# EAGLE design untitled (EAGLE 8.4.1)
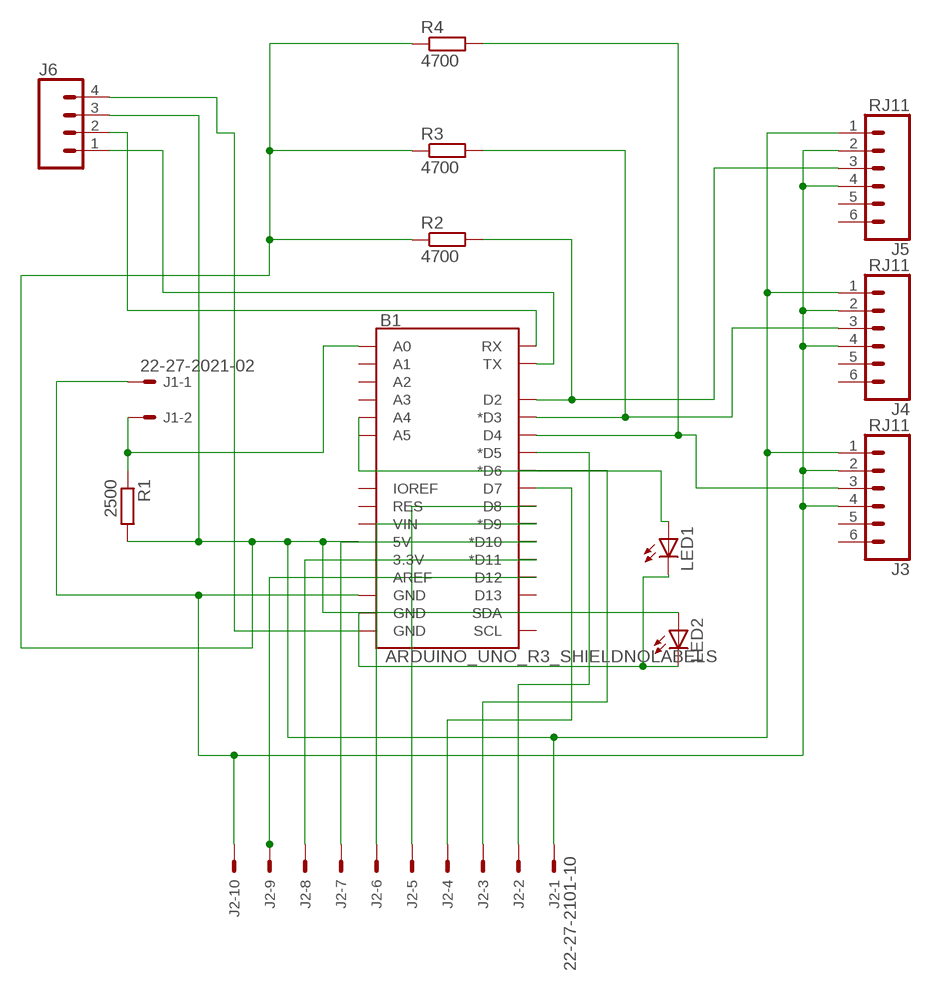
[diagram p0: schematic, sheet 1]

## Parts
B1  ARDUINO_UNO_R3_SHIELDNOLABELS  [UNO_R3_SHIELD_NOLABELS]
J1  22-27-2021-02  [6410-02]
J2  22-27-2101-10  [6410-10]
J3  RJ11  RJ11-6  [RJ11-6]
J4  RJ11  RJ11-6  [RJ11-6]
J5  RJ11  RJ11-6  [RJ11-6]
J6  CONN_04  [1X04]
LED1  LED3MM  [LED3MM]
LED2  LED3MM  [LED3MM]
R1  2500  R-EU_R1206  [R1206]
R2  4700  R-EU_R1206  [R1206]
R3  4700  R-EU_R1206  [R1206]
R4  4700  R-EU_R1206  [R1206]

## Nets
N$1: B1.5V J2.1 J3.1 J4.1 J5.1 J6.3 LED2.A R1.2 R2.1 R3.1 R4.1
N$2: B1.GND@2(GND) J1.1 J2.10 J3.2 J3.4 J4.2 J4.4 J5.2 J5.4
N$3: B1.D12 J2.9
N$4: B1.A0 J1.2 R1.1
N$5: B1.D5(*D5) J2.2
N$6: B1.D6(*D6) J2.3
N$7: B1.D2 J5.3 R2.2
N$8: B1.D3(*D3) J4.3 R3.2
N$9: B1.D4 J3.3 R4.2
N$10: B1.D7 J2.4
N$11: B1.D8 J2.5
N$12: B1.D9(*D9) J2.6
N$13: B1.D10(*D10) J2.7
N$14: B1.D11(*D11) J2.8
N$15: B1.TX J6.1
N$16: B1.RX J6.2
N$17: B1.GND@0(GND) J6.4
N$18: B1.GND@1(GND) LED1.K(C) LED2.K(C)
N$20: B1.A4 LED1.A
Unconnected: B1.3.3V B1.A1 B1.A2 B1.A3 B1.A5 B1.AREF B1.D13 B1.IOREF B1.RES B1.SCL B1.SDA B1.VIN J3.5 J3.6 J4.5 J4.6 J5.5 J5.6

## Library data of the parts
B1 = SparkFun-Boards:ARDUINO_UNO_R3_SHIELD: Arduino R3 Shield Footprint Shield form compatible with the Arduino Uno R3. SparkFun Products: MG2639 Cellular Shield <https://www.sparkfun.com/products/13120> MIDI Shield <https://www.sparkfun.com/products/12898> R3 Stackable Headers Kit <https://www.sparkfun.com/products/11417>
J1 = con-molex:22-?-02: CONNECTOR wire to board 2.54 mm (.1 inch) pitch header; OC_FARNELL: unknown; OC_NEWARK: unknown
J2 = con-molex_neu:22-?-10: CONNECTOR wire to board 2.54 mm (.1 inch) pitch header; OC_FARNELL: unknown; OC_NEWARK: unknown
J3-J5 = SparkFun-Connectors:RJ11-6: RJ11 Jack - 6 pin Commonly found on CAT3 devices and some Microchip programmers. Here is the connector we sell at SparkFun: RJ11 6-Pin Connector <https://www.sparkfun.com/products/132> (PRT-00132) Datasheet <http://www.sparkfun.com/datasheets/Prototyping/Connectors/RJ11-Datasheet.pdf> It is used on this SparkFun product: SparkFun Weather Shield <https://www.sparkfun.com/products/12081> (DEV-12081) Weather Meters <https://www.sparkfun.com/products/8942> (SEN-08942); PROD_ID: CONN-08590; SF_ID: PRT-00132
J6 = SparkFun-Connectors:CONN_04: Multi connection point. Often used as Generic Header-pin footprint for 0.1 inch spaced/style header connections On any of the 0.1 inch spaced packages, you can populate with these: Break Away Headers - Straight <https://www.sparkfun.com/products/116> (PRT-00116) Break Away Male Headers - Right Angle <https://www.sparkfun.com/products/553> (PRT-00553) Female Headers <https://www.sparkfun.com/products/115> (PRT-00115) Break Away Headers - Machine Pin <https://www.sparkfun.com/products/117> (PRT-00117) Break Away Female Headers - Swiss Machine Pin <https://www.sparkfun.com/products/743> (PRT-00743) For SCREWTERMINALS and SPRING TERMINALS visit here: Screw Terimnals on SparkFun.com <https://www.sparkfun.com/search/results?term=Screw+Terminals> (5mm/3.5mm/2.54mm spacing) This device is also useful as a general connection point to wire up your design to another part of your project. Our various solder wires solder well into these plated through hole pads. Hook-Up Wire - Assortment (Stranded, 22 AWG) <https://www.sparkfun.com/products/11375> (PRT-11375) Hook-Up Wire - Assortment (Solid Core, 22 AWG) <https://www.sparkfun.com/products/11367> (PRT-11367) View the entire wire category on our website here <https://www.sparkfun.com/categories/141> Special notes: Molex polarized connector foot print use with SKU : PRT-08231 with associated crimp pins and housings. 1MM SMD Version SKU: PRT-10208; PROD_ID: CONN-09696
LED1 LED2 = led_neu:LED: LED OSRAM: - CHIPLED LG R971, LG N971, LY N971, LG Q971, LY Q971, LO R971, LY R971 LH N974, LH R974 LS Q976, LO Q976, LY Q976 LO Q996 - Hyper CHIPLED LW Q18S LB Q993, LB Q99A, LB R99A - SideLED LS A670, LO A670, LY A670, LG A670, LP A670 LB A673, LV A673, LT A673, LW A673 LH A674 LY A675 LS A676, LA A676, LO A676, LY A676, LW A676 LS A679, LY A679, LG A679 - Hyper Micro SIDELED® LS Y876, LA Y876, LO Y876, LY Y876 LT Y87S - SmartLED LW L88C, LW L88S LB L89C, LB L89S, LG L890 LS L89K, LO L89K, LY L89K LS L896, LA L896, LO L896, LY L896 - TOPLED LS T670, LO T670, LY T670, LG T670, LP T670 LSG T670, LSP T670, LSY T670, LOP T670, LYG T670 LG T671, LOG T671, LSG T671 LB T673, LV T673, LT T673, LW T673 LH T674 LS T676, LA T676, LO T676, LY T676, LB T676, LH T676, LSB T676, LW T676 LB T67C, LV T67C, LT T67C, LS T67K, LO T67K, LY T67K, LW E67C LS E67B, LA E67B, LO E67B, LY E67B, LB E67C, LV E67C, LT E67C LW T67C LS T679, LY T679, LG T679 LS T770, LO T770, LY T770, LG T770, LP T770 LB T773, LV T773, LT T773, LW T773 LH T774 LS E675, LA E675, LY E675, LS T675 LS T776, LA T776, LO T776, LY T776, LB T776 LHGB T686 LT T68C, LB T68C - Hyper Mini TOPLED® LB M676 - Mini TOPLED Santana® LG M470 LS M47K, LO M47K, LY M47K Source: http://www.osram.convergy.de LUXEON: - LUMILED® LXK2-PW12-R00, LXK2-PW12-S00, LXK2-PW14-U00, LXK2-PW14-V00 LXK2-PM12-R00, LXK2-PM12-S00, LXK2-PM14-U00 LXK2-PE12-Q00, LXK2-PE12-R00, LXK2-PE12-S00, LXK2-PE14-T00, LXK2-PE14-U00 LXK2-PB12-K00, LXK2-PB12-L00, LXK2-PB12-M00, LXK2-PB14-N00, LXK2-PB14-P00, LXK2-PB14-Q00 LXK2-PR12-L00, LXK2-PR12-M00, LXK2-PR14-Q00, LXK2-PR14-R00 LXK2-PD12-Q00, LXK2-PD12-R00, LXK2-PD12-S00 LXK2-PH12-R00, LXK2-PH12-S00 LXK2-PL12-P00, LXK2-PL12-Q00, LXK2-PL12-R00 Source: www.luxeon.com KINGBRIGHT: KA-3528ASYC Source: www.kingbright.com
R1-R4 = resistor:R-EU_: RESISTOR, European symbol

## Net classes
0 default: clearance 0.205 mm

## Board
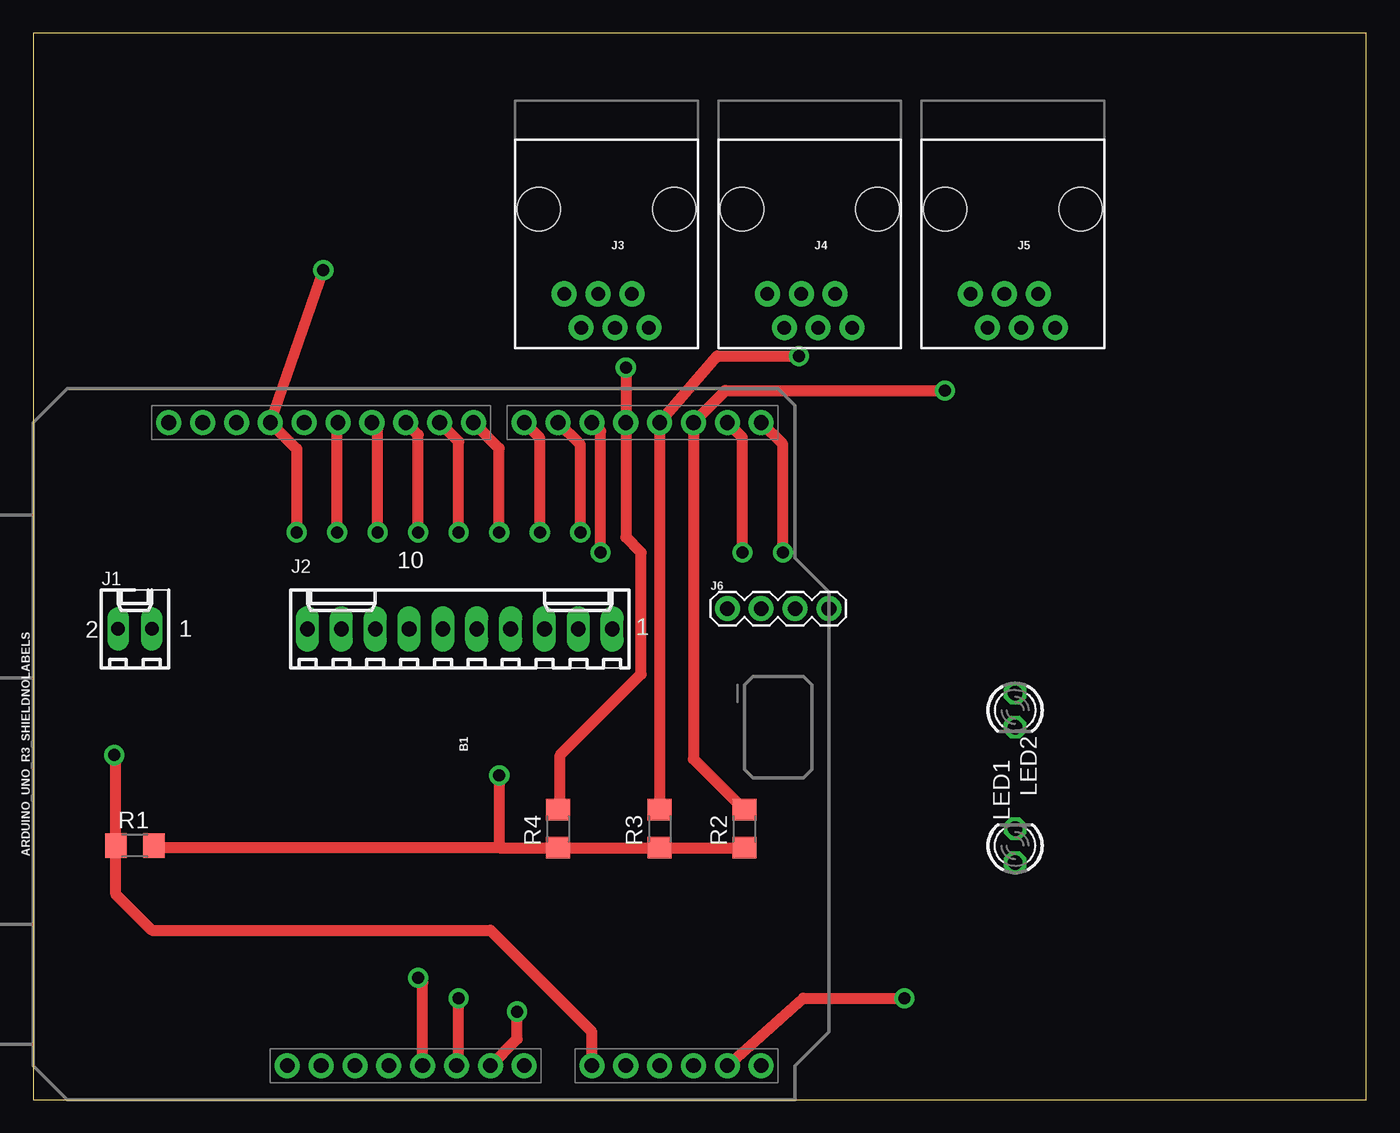
[diagram p1: board, top side]
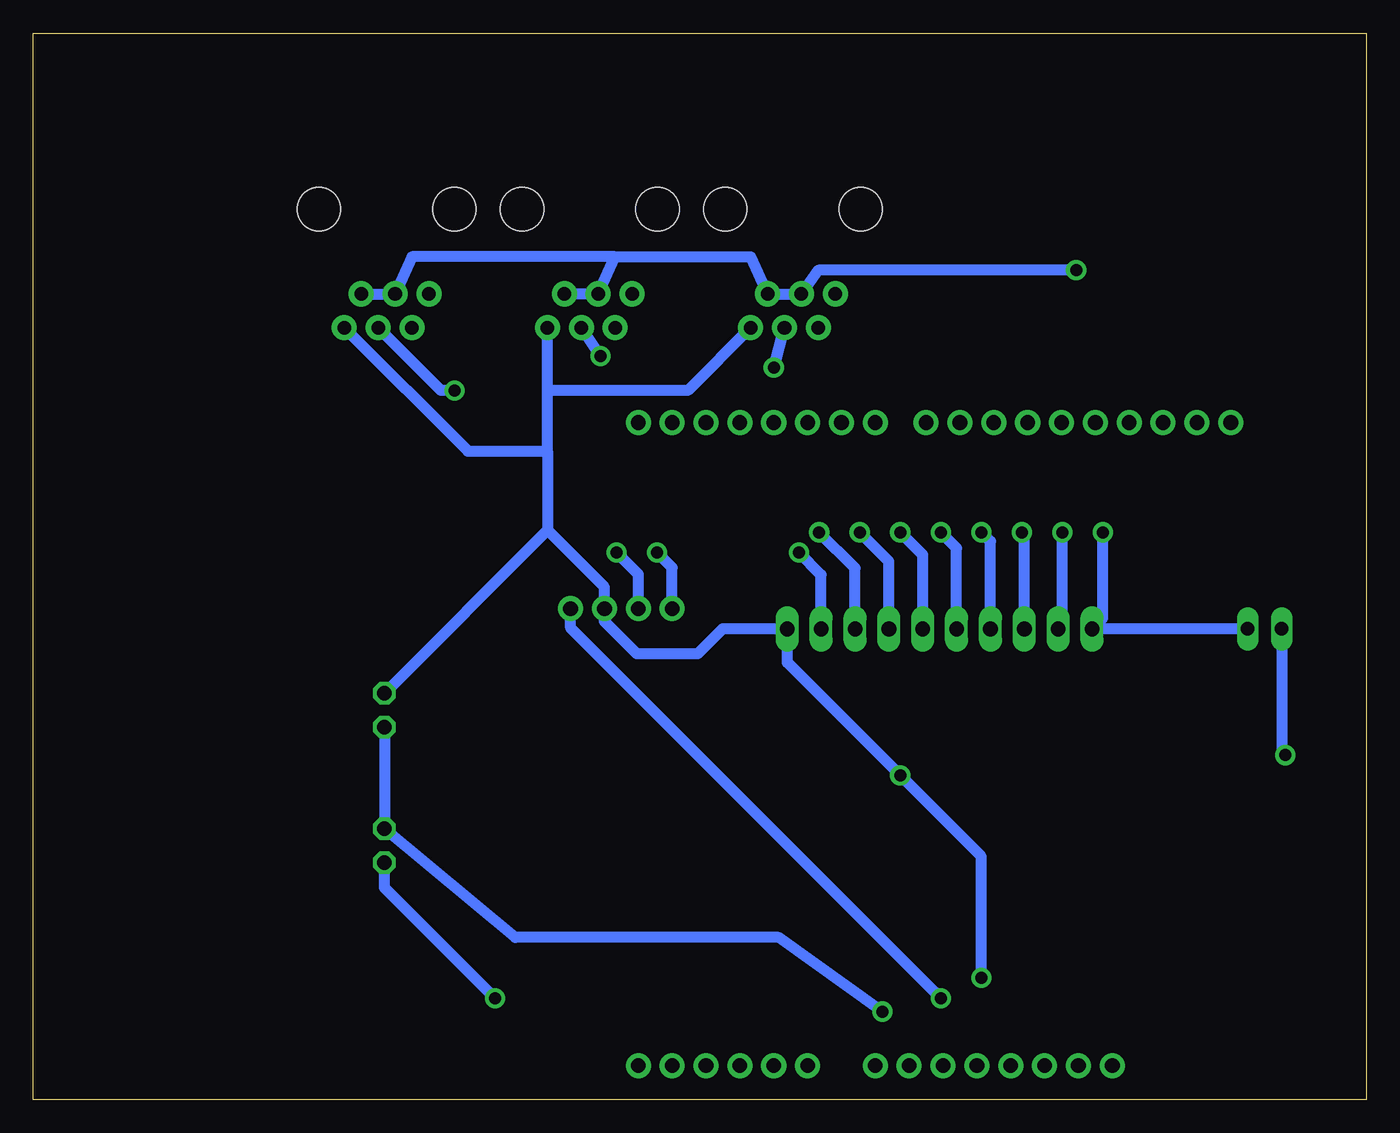
[diagram p2: board, bottom side, seen from below]

Size 100 x 80 mm. Coordinates in mm from the lower left corner, seen from the top.
Outline: 0,0 100,0 100,80 0,80 0,0
Copper layers (1*16): Top 0.035mm / dielectric 1.5mm / Bottom 0.035mm
Design rules "default *": minimum track width 32mil, minimum drill 0.35mm, track to track 8mil, track to pad 8mil, pad to pad 8mil, via to via 8mil, smd to smd 6mil, copper to edge 40mil, drill to drill 12mil, minimum pad ring 12mil, minimum via ring 12mil, stop-mask expansion 4mil, vias tented up to drill 0mil, thermal gap 10mil

### Footprints (pad centres in the part's own frame; a part is rotated, then mirrored left to right if it is on the bottom)
UNO_R3_SHIELD_NOLABELS = drill 1.1 pad 1.88: 3.3V 24.13,-3.81; 5V 24.13,-1.27; A0 24.13,11.43; A1 24.13,13.97; A2 24.13,16.51; A3 24.13,19.05; A4 24.13,21.59; A5 24.13,24.13; AREF -24.13,-15.24; D2 -24.13,19.05; D3 -24.13,16.51; D4 -24.13,13.97; D5 -24.13,11.43; D6 -24.13,8.89; D7 -24.13,6.35; D8 -24.13,2.54; D9 -24.13,0; D10 -24.13,-2.54; D11 -24.13,-5.08; D12 -24.13,-7.62; D13 -24.13,-10.16; GND@0 24.13,1.27; GND@1 24.13,3.81; GND@2 -24.13,-12.7; IOREF 24.13,-8.89; NC 24.13,-11.43; RES 24.13,-6.35; RX -24.13,24.13; SCL -24.13,-20.32; SDA -24.13,-17.78; TX -24.13,21.59; VIN 24.13,6.35
6410-02 = drill 1.016 long: 1 1.27,0; 2 -1.27,0
6410-10 = drill 1.1 long: 1 11.43,0; 2 8.89,0; 3 6.35,0; 4 3.81,0; 5 1.27,0; 6 -1.27,0; 7 -3.81,0; 8 -6.35,0; 9 -8.89,0; 10 -11.43,0
RJ11-6 = drill 1.016 pad 1.88: 1 -3.175,8.89; 2 -1.905,6.35; 3 -0.635,8.89; 4 0.635,6.35; 5 1.905,8.89; 6 3.175,6.35 | hole 3.251: -5.08,0; 5.08,0
1X04 = drill 1.1 pad 1.88: 1 0,0; 2 2.54,0; 3 5.08,0; 4 7.62,0
LED3MM = drill 1.1 octagon: A -1.27,0; K 1.27,0
R1206 = smd 1.6 x 1.803: 1 -1.422,0; 2 1.422,0

### Placement (x,y rotation side)
B1  30.48,26.67 270 top
J1  7.62,35.31 0 top
J2  32,35.31 0 top
J3  43.01,66.8 180 top
J4  58.25,66.8 180 top
J5  73.49,66.8 180 top
J6  52.07,36.83 0 top
LED1  73.66,19.05 90 top
LED2  73.66,29.21 270 top
R1  7.62,19.05 0 top
R2  53.34,20.32 90 top
R3  46.99,20.32 90 top
R4  39.37,20.32 90 top

### Tracks (layer width: path | path; a pad name or v marks a point on that pad's centre or on a via)
N$1  (via drill 0.9)
  Top 0.813: R2.1 R3.1 R4.1 34.96,18.9 | R1.2 9.19,18.9 34.96,18.9 | v34.96,24.32 34.96,18.9 | B1.5V 29.21,8.79 v28.88,9.12
  Bottom 0.813: 61.42,53.2 J4.1 | J3.1 50.9,53.2 61.42,53.2 | LED2.A 61.42,42.72 | 61.42,42.72 57.15,38.44 J6.3 57.15,35.87 54.72,33.44 50.16,33.44 48.29,35.31 J2.1 43.43,32.79 v34.96,24.32 28.88,18.24 v28.88,9.12 | 61.42,48.64 61.42,53.2 | 61.42,48.64 61.42,42.72 | J5.1 67.39,48.64 61.42,48.64
N$2  (via drill 0.9)
  Top 0.813: v21.76,62.22 B1.GND@2 19.76,48.82 v19.76,42.56
  Bottom 0.813: J5.2 J5.4 71.58,63.24 56.34,63.24 | 56.34,63.24 J4.4 J4.2 | v21.76,62.22 41.1,62.22 J3.4 J3.2 46.19,63.24 56.34,63.24 | J1.1 J2.10 19.76,36.12 v19.76,42.56
N$3  (via drill 0.9)
  Top 0.813: v22.8,42.56 22.8,50.74 B1.D12
  Bottom 0.813: J2.9 22.8,35.62 v22.8,42.56
N$4  (via drill 0.9)
  Top 0.813: B1.A0 41.91,5.08 34.29,12.7 8.89,12.7 6.2,15.39 R1.1 6.2,25.72 v6.08,25.84
  Bottom 0.813: J1.2 6.35,26.11 v6.08,25.84
N$5  (via drill 0.9)
  Top 0.813: v42.56,41.04 42.56,50.15 B1.D5
  Bottom 0.813: J2.2 40.89,39.37 v42.56,41.04
N$6  (via drill 0.9)
  Top 0.813: v41.04,42.56 41.04,49.13 B1.D6
  Bottom 0.813: J2.3 38.35,39.87 v41.04,42.56
N$7  (via drill 0.9)
  Top 0.813: R2.2 49.53,25.55 B1.D2 51.93,53.2 v68.4,53.2
  Bottom 0.813: v68.4,53.2 69.42,53.2 J5.3
N$8  (via drill 0.9)
  Top 0.813: R3.2 B1.D3 51.3,55.79 v57.45,55.79
  Bottom 0.813: v57.45,55.79 J4.3
N$9  (via drill 0.9)
  Top 0.813: v44.45,54.91 B1.D4 44.45,42.19 45.6,41.04 45.6,31.92 39.52,25.84 39.52,21.89 R4.2
  Bottom 0.813: v44.45,54.91 J3.3
N$10  (via drill 0.9)
  Top 0.813: v38,42.56 38,49.63 B1.D7
  Bottom 0.813: J2.4 35.81,40.37 v38,42.56
N$11  (via drill 0.9)
  Top 0.813: v34.96,42.56 34.96,48.86 B1.D8
  Bottom 0.813: J2.5 33.27,40.87 v34.96,42.56
N$12  (via drill 0.9)
  Top 0.813: v31.92,42.56 31.92,49.36 B1.D9
  Bottom 0.813: J2.6 30.73,41.37 v31.92,42.56
N$13  (via drill 0.9)
  Top 0.813: v28.88,42.56 28.88,49.86 B1.D10
  Bottom 0.813: J2.7 28.19,41.87 v28.88,42.56
N$14  (via drill 0.9)
  Top 0.813: v25.84,42.56 25.84,50.36 B1.D11
  Bottom 0.813: J2.8 25.65,42.37 v25.84,42.56
N$15  (via drill 0.9)
  Top 0.813: v53.2,41.04 53.2,49.67 B1.TX
  Bottom 0.813: J6.1 52.07,39.91 v53.2,41.04
N$16  (via drill 0.9)
  Top 0.813: v56.24,41.04 56.24,49.17 B1.RX
  Bottom 0.813: J6.2 54.61,39.41 v56.24,41.04
N$17  (via drill 0.9)
  Top 0.813: B1.GND@0 31.92,2.71 v31.92,7.6
  Bottom 0.813: v31.92,7.6 59.69,35.37 J6.4
N$18  (via drill 0.9)
  Top 0.813: B1.GND@1 36.3,4.55 v36.3,6.6
  Bottom 0.813: LED2.K LED1.K 63.84,12.16 44.08,12.16 v36.3,6.6
N$20  (via drill 0.9)
  Top 0.813: B1.A4 57.76,7.6 v65.36,7.6
  Bottom 0.813: v65.36,7.6 73.66,15.9 LED1.A